# EAGLE design rotarydial (EAGLE 6.6.0)
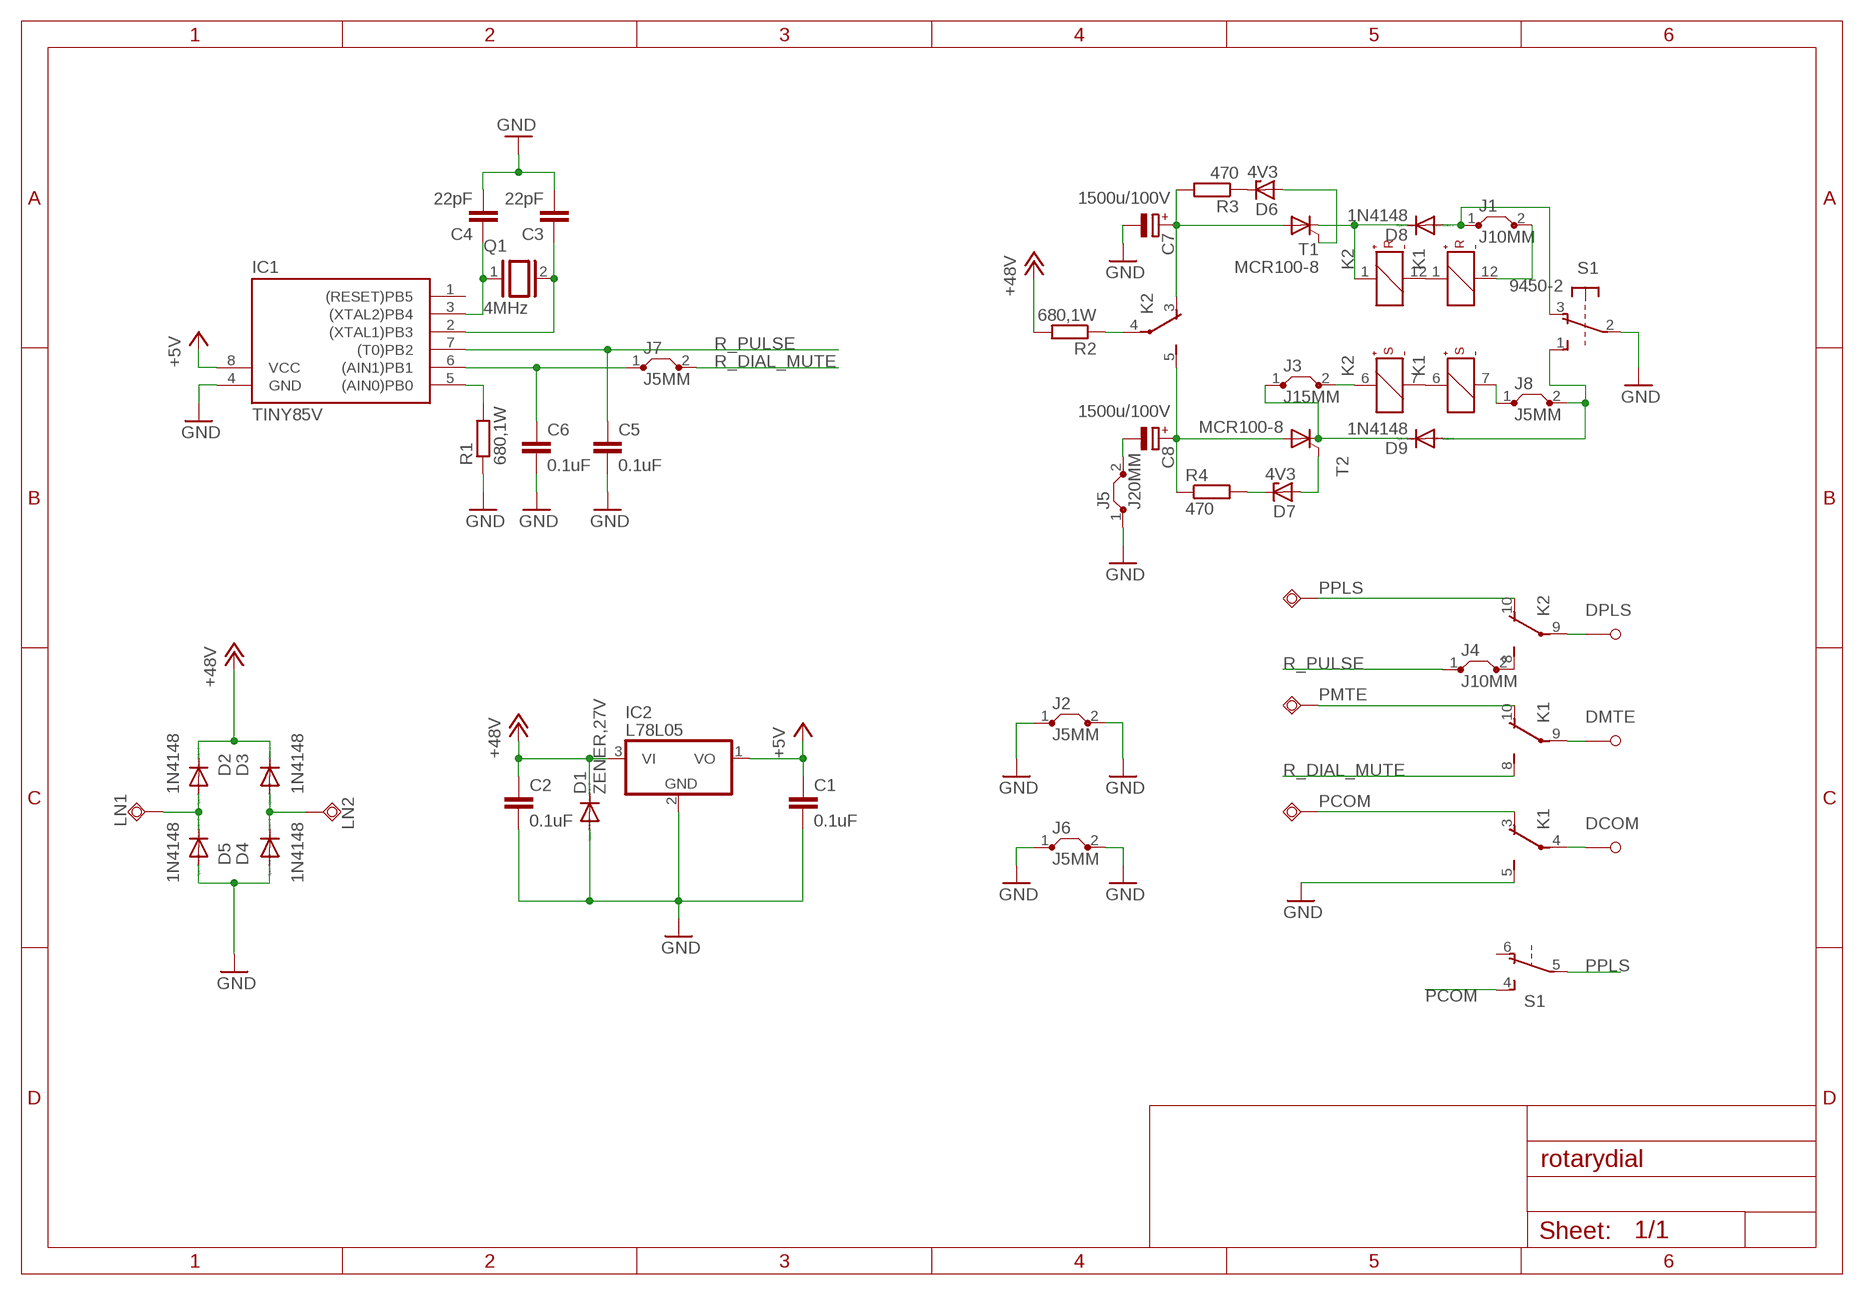
[diagram p0: schematic, sheet 1]

## Parts
C1  0.1uF  C-EU050-025X075  [C050-025X075]
C2  0.1uF  C-EU050-025X075  [C050-025X075]
C3  22pF  C-EU050-024X044  [C050-024X044]
C4  22pF  C-EU050-024X044  [C050-024X044]
C5  0.1uF  C-EU050-025X075  [C050-025X075]
C6  0.1uF  C-EU050-025X075  [C050-025X075]
C7  1500u/100V  CPOL-EUE7.5-18  [E7,5-18]
C8  1500u/100V  CPOL-EUE7.5-18  [E7,5-18]
D1  ZENER,27V  DIODE-P2-15  [P2-15]
D2  1N4148  1N4933  [DO41-10]
D3  1N4148  1N4933  [DO41-10]
D4  1N4148  1N4933  [DO41-10]
D5  1N4148  1N4933  [DO41-10]
D6  4V3  BZV10  [DO34Z7]
D7  4V3  BZV10  [DO34Z7]
D8  1N4148  1N4933  [DO41-10]
D9  1N4148  1N4933  [DO41-10]
DCOM  M3-SCREW-CONNECTOR  [M3-SCREW-CONNECTOR]
DMTE  M3-SCREW-CONNECTOR  [M3-SCREW-CONNECTOR]
DPLS  M3-SCREW-CONNECTOR  [M3-SCREW-CONNECTOR]
IC1  TINY85V  TINY10P  [DIL08]
IC2  L78L05  78L05Z  [TO92]
J1  J10MM  [10]
J2  J5MM  [05]
J3  J15MM  [15]
J4  J10MM  [10]
J5  J20MM  [20]
J6  J5MM  [05]
J7  J5MM  [05]
J8  J5MM  [05]
K1  EC2-3TNU  TX2LT-L2-  [TX2-L2]
K2  EC2-3TNU  TX2LT-L2-  [TX2-L2]
LN1  TPSQPAD1-20  [P1-20]
LN2  TPSQPAD1-20  [P1-20]
PCOM  TPSQPAD1-20  [P1-20]
PMTE  TPSQPAD1-20  [P1-20]
PPLS  TPSQPAD1-20  [P1-20]
Q1  4MHz  XTAL/S  [QS]
R1  680,1W  R-EU_0414/5V  [0414V]
R2  680,1W  R-EU_0414/5V  [0414V]
R3  470  R-EU_0207/7  [0207/7]
R4  470  R-EU_0207/7  [0207/7]
S1  9450-2  [9450-2]
T1  MCR100-8  BT169  [TO92-2]
T2  MCR100-8  BT169  [TO92-2]

## Nets
+5V: C1.1 IC1.8(VCC) IC2.1(VO)
+12V: C2.1 D1.C D2.C D3.C IC2.3(VI) R2.2 ; supply symbol labelled +48V
GND: C1.2 C2.2 C3.2 C4.2 C5.2 C6.2 C7.- C8.- D1.A D4.A D5.A IC1.4(GND) IC2.2(GND) J2.1 J2.2 J5.1 J5.2 J6.1 J6.2 K1.5(1:S) R1.1 S1.2(1:P)
N$1: D2.A D5.C LN1.TP
N$2: D3.A D4.C LN2.TP
N$3: IC1.5((AIN0)PB0) R1.2
N$4: C7.+ K2.3(1:O) R3.2 T1.A
N$5: K1.1(R:+) K2.12(R:-)
N$6: J1.2 K1.12(R:-)
N$7: J3.2 K2.6(S:+)
N$8: D8.C K2.1(R:+) T1.C
N$9: C4.1 IC1.3((XTAL2)PB4) Q1.1
N$10: DPLS.P$1 DPLS.P$2 DPLS.P$3 DPLS.P$4 K2.9(2:P)
N$11: K1.6(S:+) K2.7(S:-)
N$13: C3.1 IC1.2((XTAL1)PB3) Q1.2
N$14: D9.C J3.1 T2.C
N$15: C8.+ K2.5(1:S) R4.1 T2.A
N$16: J8.1 K1.7(S:-)
N$17: D9.A J8.2 S1.1(1:S)
N$18: DMTE.P$1 DMTE.P$2 DMTE.P$3 DMTE.P$4 K1.9(2:P)
N$20: DCOM.P$1 DCOM.P$2 DCOM.P$3 DCOM.P$4 K1.4(1:P)
N$22: D6.C R3.1
N$23: D7.C R4.2
N$24: D6.A T1.G
N$25: D7.A T2.G
N$26: D8.A J1.1 S1.3(1:O)
N$28: J4.2 K2.8(2:S)
PCOM: K1.3(1:O) PCOM.TP S1.4(2:S)
PMTE: K1.10(2:O) PMTE.TP
PPLS: K2.10(2:O) PPLS.TP S1.5(2:P)
R2: K2.4(1:P) R2.1
R_DIAL_MUTE: C6.1 IC1.6((AIN1)PB1) J7.1 J7.2 K1.8(2:S)
R_PULSE: C5.1 IC1.7((T0)PB2) J4.1
Unconnected: IC1.1((RESET)PB5) S1.6(2:O)

## Library data of the parts
C1-C6 = resistor:C-EU: CAPACITOR, European symbol
C7 C8 = resistor-custom:CPOL-EU: POLARIZED CAPACITOR, European symbol
D1 = diode:DIODE-: DIODE
D2-D5 D8 D9 = diode:1N4933: DIODE fast recovery rectifier, 1A
D6 D7 = diode:BZV10: Z DIODE
DCOM DMTE DPLS = m3conn:M3-SCREW-CONNECTOR
IC1 = atmel:TINY10: MICROCONTROLLER 1 Kbytes ROM; OC_FARNELL: unknown; OC_NEWARK: unknown
IC2 = linear:78*: Positive VOLTAGE REGULATOR Source: http://cache.national.com/ds/LM/LM78L05.pdf http://www.fairchildsemi.com/ds/LM/LM7805.pdf
J1-J8 = jumper:J: Bridge
K1 K2 = relay-custom:TX2?-L2-*: TX Relay 2 coil latching NAiS 2 AMP. HIGH CAPACITY RELAY WITH HIGH SURGE VOLTAGE & HIGH BREAKDOWN VOLTAGE Source: http://www.mew-europe.com/.. en_ds_61022_0001.pdf TX-S SMALL POLARIZED WITH HIGH SENSITIVITY 50mW Source: http://www.mew-europe.com/.. en_ds_61022_0022.pdf
LN1 LN2 PCOM PMTE PPLS = testpad:TPSQ: Test pad
Q1 = special:XTAL/S: CRYSTAL
R1-R4 = resistor:R-EU_: RESISTOR, European symbol
S1 = switch-misc:9450-2: MARQUARDT SWITCH
T1 T2 = triac:BT169: THYRISTOR

## Board
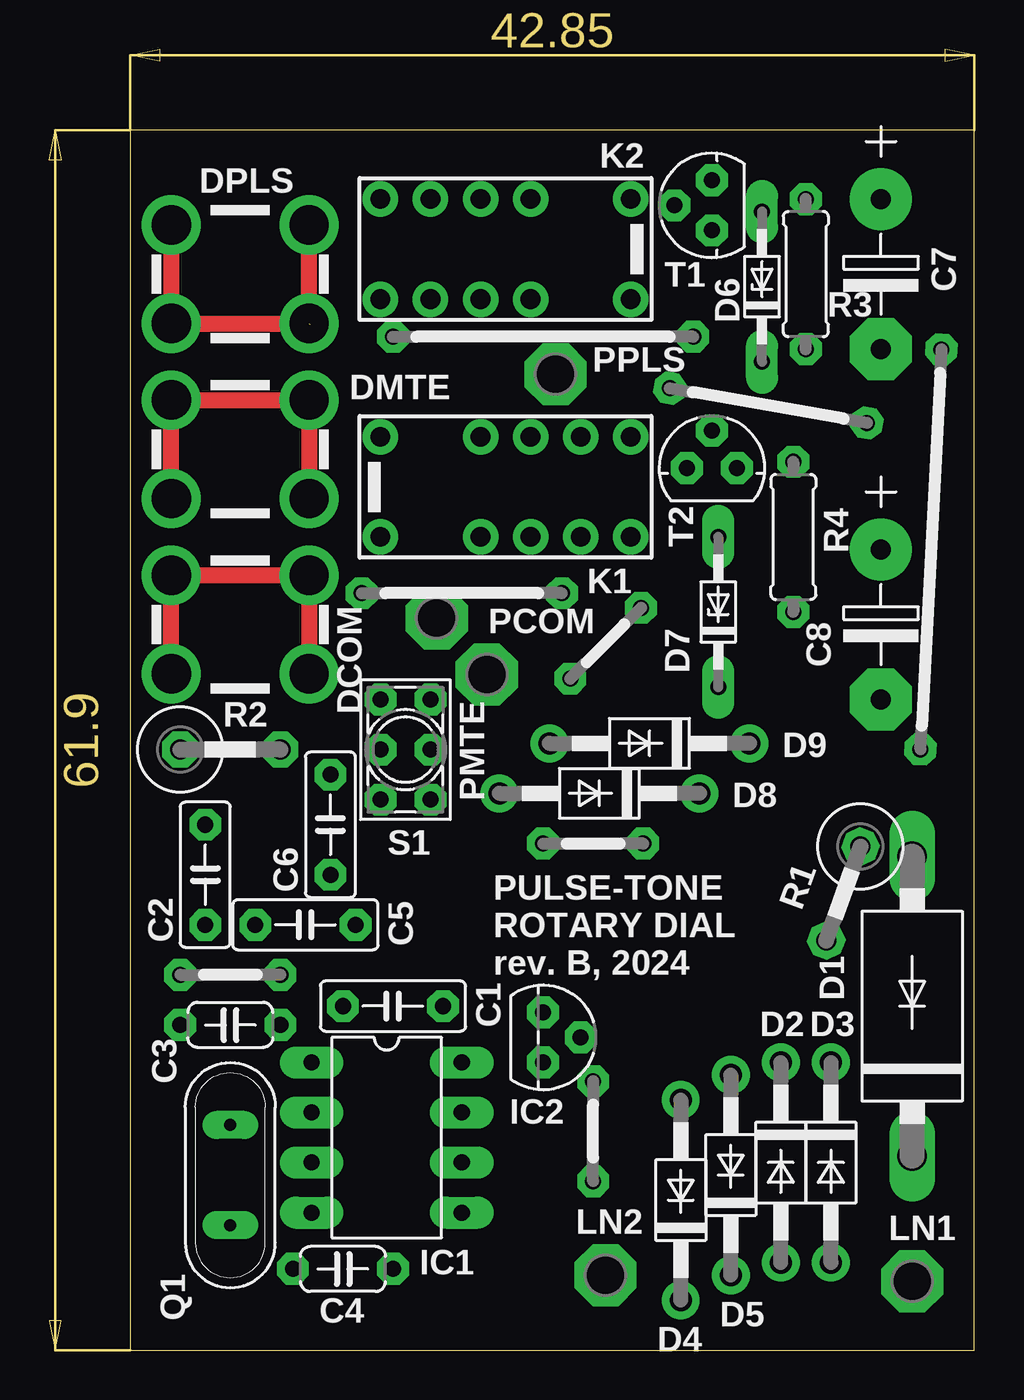
[diagram p1: board, top side]
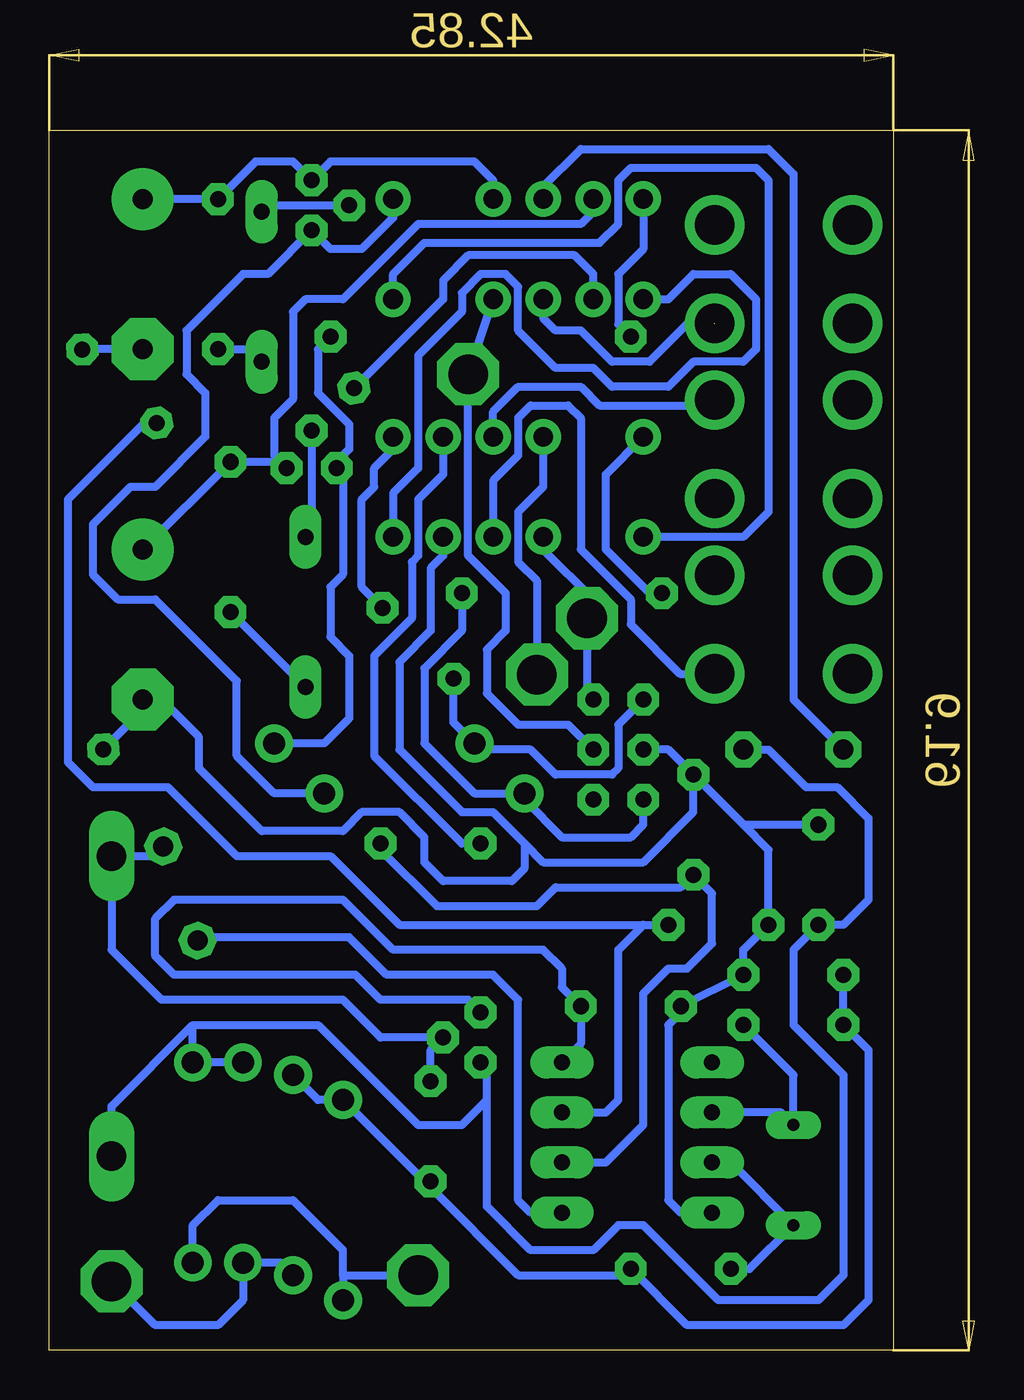
[diagram p2: board, bottom side, seen from below]

Size 42.85 x 61.9 mm. Coordinates in mm from the lower left corner, seen from the top.
Outline: 0,0 42.85,0 42.85,61.9 0,61.9 0,0
Copper layers (1*16): Top 0.035mm / dielectric 1.5mm / Bottom 0.035mm
Design rules "default *": minimum track width 0.3mm, minimum drill 0.6mm, track to track 6mil, track to pad 6mil, pad to pad 6mil, via to via 6mil, smd to smd 0mil, copper to edge 0.3mm, drill to drill 0.5mm, minimum pad ring 0.4mm, minimum via ring 8mil, stop-mask expansion 4mil, vias tented up to drill 0mil, thermal gap 10mil

### Footprints (pad centres in the part's own frame; a part is rotated, then mirrored left to right if it is on the bottom)
C050-025X075 = drill 0.813 octagon: 1 -2.54,0; 2 2.54,0
C050-024X044 = drill 0.813 octagon: 1 -2.54,0; 2 2.54,0
E7,5-18 = drill 1.016 pad 3.15: + -3.81,0 | drill 1.016 pad 3.15 octagon: - 3.81,0
P2-15 = drill 1.499 long: A 7.62,0; C -7.62,0
DO41-10 = drill 1.118: A 5.08,0; C -5.08,0
DO34Z7 = drill 0.813 long: A 3.81,0; C -3.81,0
M3-SCREW-CONNECTOR = drill 2: P$1 -2.5,3; P$2 2.5,3; P$3 -2.5,-4; P$4 2.5,-4
DIL08 = drill 0.813 long: 1 -3.81,-3.81; 2 -1.27,-3.81; 3 1.27,-3.81; 4 3.81,-3.81; 5 3.81,3.81; 6 1.27,3.81; 7 -1.27,3.81; 8 -3.81,3.81
TO92 = drill 0.813 octagon: 1 -1.27,0; 2 0,1.905; 3 1.27,0
10 = drill 0.813 pad 1.6 octagon: 1 -5.08,0; 2 5.08,0
05 = drill 0.813 pad 1.6 octagon: 1 -2.54,0; 2 2.54,0
15 = drill 0.813 pad 1.6 octagon: 1 -7.62,0; 2 7.62,0
20 = drill 0.813 pad 1.6 octagon: 1 -10.16,0; 2 10.16,0
TX2-L2 = drill 1: 1 -6.35,-2.54; 3 -1.27,-2.54; 4 1.27,-2.54; 5 3.81,-2.54; 6 6.35,-2.54; 7 6.35,2.54; 8 3.81,2.54; 9 1.27,2.54; 10 -1.27,2.54; 12 -6.35,2.54
P1-20 = drill 2.007 pad 3.15 octagon: TP 0,0
QS = drill 0.61 long: 1 -2.54,0; 2 2.54,0
0414V = drill 1.016 octagon: 1 -2.54,0; 2 2.54,0
0207/7 = drill 0.813 octagon: 1 -3.81,0; 2 3.81,0
9450-2 = drill 0.813 octagon: 1 -2.54,-1.27; 2 0,-1.27; 3 2.54,-1.27; 4 -2.54,1.27; 5 0,1.27; 6 2.54,1.27
TO92-2 = drill 0.813 octagon: A 1.27,0; C -1.27,0; G 0,1.905

### Placement (x,y rotation side)
C1  13.34,17.46 180 top
C2  3.81,24.13 90 top
C3  5.08,16.51 180 top
C4  10.79,4.13 0 top
C5  8.89,21.59 180 top
C6  10.16,26.67 90 top
C7  38.1,54.61 270 top
C8  38.1,36.83 270 top
D1  39.69,17.46 90 top
D2  33.02,9.53 270 top
D3  35.56,9.53 270 top
D4  27.94,7.62 90 top
D5  30.48,8.89 90 top
D6  32.07,53.98 90 top
D7  29.84,37.47 90 top
D8  23.81,28.26 180 top
D9  26.35,30.8 180 top
DCOM  5.08,36.83 90 top
DMTE  5.08,45.72 90 top
DPLS  5.08,54.61 90 top
IC1  13.02,10.79 270 top
IC2  20.95,15.88 270 top
J1  16.83,38.42 180 top
J2  23.5,11.11 90 top
J3  20.95,51.44 180 top
J4  32.38,47.94 170 top
J5  40.64,40.64 267 top
J6  5.08,19.05 180 top
J7  23.5,25.72 0 top
J8  24.13,35.88 225 top
K1  19.05,43.81 0 top
K2  19.05,55.88 180 top
LN1  39.69,3.49 0 top
LN2  24.13,3.81 0 top
PCOM  15.56,37.15 0 top
PMTE  18.1,34.29 0 top
PPLS  21.59,49.53 0 top
Q1  5.08,8.89 90 top
R1  36.2,23.18 250 top
R2  5.08,30.48 0 top
R3  34.29,54.61 90 top
R4  33.66,41.27 270 top
S1  13.97,30.48 270 top
T1  29.53,58.1 90 top
T2  29.53,44.77 0 top

### Tracks (layer width: path | path; a pad name or v marks a point on that pad's centre or on a via)
+5V
  Bottom 0.406: IC1.8 15.88,15.56 C1.1 16.83,18.41 16.83,19.37 17.78,20.32 25.4,20.32 27.94,22.86 36.51,22.86 37.47,21.91 37.47,20 36.51,19.05 27.3,19.05 26.04,17.78 21.59,17.78 IC2.1
+12V
  Bottom 0.406: R2.2 6.35,30.48 4.45,28.57 2.86,28.57 1.27,26.99 1.27,22.86 2.54,21.59 C2.1 5.08,20.32 5.08,16.51 2.54,13.97 2.54,3.81 3.81,2.54 8.89,2.54 12.7,6.35 13.97,6.35 15.24,5.08 18.41,5.08 20.64,7.3 20.64,12.7 | 20.64,12.7 20.64,14.29 IC2.3 | D1.C 39.69,12.38 35.56,16.51 | 35.56,16.51 29.21,16.51 24.13,11.43 21.91,11.43 20.64,12.7 | D2.C D3.C 35.56,16.51
GND
  Top 0.406: J6.1 J6.2 | J2.2 J2.1 | J5.2 J5.1
  Bottom 0.406: K1.5 22.86,40.32 23.5,39.69 23.5,36.51 25.08,34.92 25.08,30.48 21.91,27.3 20.32,27.3 18.73,25.72 | C6.2 11.43,30.48 S1.2 | 18.73,25.72 18.73,24.45 19.37,23.81 22.86,23.81 23.81,24.77 23.81,26.04 25.08,27.3 26.99,27.3 27.94,26.35 32.07,26.35 35.24,29.53 35.24,31.11 37.15,33.02 C8.- 38.1,32.5 J5.2 | 18.73,25.72 17.78,24.77 12.7,24.77 10.16,27.3 C6.2 | C6.2 7.62,26.67 | 7.62,26.67 C2.2 | 7.62,26.67 6.35,25.4 C5.2 7.62,20.32 J6.1 C1.2 10.79,17.14 11.43,16.51 11.43,7.62 10.79,6.99 IC1.4 | J6.2 C3.2 1.27,15.24 1.27,2.54 2.54,1.27 10.48,1.27 C4.2 13.65,3.81 19.05,3.81 23.5,8.26 | R1.1 37.47,25.08 D1.A 39.69,20.32 37.15,17.78 27.94,17.78 26.04,15.88 IC2.2 23.5,15.24 J2.2 | 23.5,8.26 J2.1 23.81,8.57 | C7.- 41.16,50.8 J5.1 | 23.5,8.26 D4.A 29.21,12.7 D5.A
N$1
  Bottom 0.406: LN1.TP 37.47,1.27 34.29,1.27 33.02,2.54 D2.A 31.11,4.45 D5.C
N$2
  Bottom 0.406: D3.A 35.56,6.35 34.29,7.62 30.48,7.62 27.94,5.08 27.94,3.81 | 27.94,3.81 LN2.TP | 27.94,3.81 D4.C
N$3
  Bottom 0.406: IC1.5 18.41,6.99 19.05,7.62 19.05,17.78 20.32,19.05 25.72,19.05 27.62,20.95 35.16,20.95 R1.2
N$4
  Bottom 0.406: K2.3 20.32,59.37 21.27,60.33 28.57,60.33 T1.A 30.48,60.33 32.38,60.33 R3.2 C7.+
N$5
  Bottom 0.406: K1.1 7.62,41.27 6.35,42.55 6.35,59.37 6.99,60.01 13.34,60.01 13.97,59.37 13.97,57.15 14.92,56.2 23.81,56.2 25.4,54.61 K2.12
N$6
  Bottom 0.406: J1.2 12.38,38.42 14.61,40.64 14.61,44.45 K1.12
N$7
  Bottom 0.406: K2.6 12.7,55.88 13.97,54.61 13.97,52.07 J3.2
N$8
  Bottom 0.406: K2.1 25.4,57.47 26.99,55.88 28.57,55.88 T1.C 31.75,54.61 33.02,54.61 35.88,51.75 35.88,49.53 34.92,48.58 34.92,46.35 37.47,43.81 38.73,43.81 40.64,41.91 40.64,39.37 39.37,38.1 37.47,38.1 33.34,33.97 33.34,30.16 31.43,28.26 D8.C
N$9
  Bottom 0.406: IC1.3 8.26,9.53 Q1.1 7.3,4.13 C4.1
N$10  (1 unrouted)
  Top 0.813: DPLS.P$2 DPLS.P$1 DPLS.P$3 DPLS.P$4
  Bottom 0.406: K2.9 17.78,52.39 17.14,51.75 15.88,51.75 14.29,50.16 12.38,50.16 10.48,52.07 9.12,52.07
N$11
  Bottom 0.406: K2.7 11.43,53.34 10.16,54.61 8.26,54.61 6.99,53.34 6.99,50.8 7.62,50.16 10.16,50.16 11.43,48.9 14.29,48.9 15.24,49.85 17.14,49.85 19.05,51.75 19.05,53.98 19.68,54.61 20.95,54.61 21.91,53.66 21.91,52.7 24.13,50.48 24.13,44.77 25.4,43.5 K1.6
N$13
  Bottom 0.406: C3.1 5.08,13.97 Q1.2 5.71,12.06 IC1.2
N$14
  Bottom 0.406: J3.1 29.21,50.8 29.21,48.58 27.62,46.99 27.62,45.72 28.26,45.09 T2.C 27.94,44.45 27.94,39.37 28.57,38.73 28.57,36.2 27.62,35.24 27.62,32.07 28.89,30.8 D9.C
N$15
  Bottom 0.406: C8.+ R4.1 31.11,45.09 T2.A 31.43,45.4 31.43,47.31 30.48,48.26 30.48,52.7 29.84,53.34 27.94,53.34 24.13,57.15 15.88,57.15 15.24,57.78 K2.5
N$16
  Bottom 0.406: J8.1 26.99,38.73 26.99,43.18 26.35,43.81 26.35,44.77 25.4,45.72 K1.7
N$17
  Bottom 0.406: S1.1 13.97,31.75 13.97,29.53 14.29,29.21 17.14,29.21 18.41,30.48 20.95,30.48 D9.A 22.33,31.86 J8.2
N$18
  Top 0.813: DMTE.P$1 DMTE.P$2 DMTE.P$4 DMTE.P$3
  Bottom 0.406: K1.9 20.32,47.62 19.05,48.9 15.88,48.9 14.92,47.94 9.12,47.94 DMTE.P$4
N$20
  Top 0.813: DCOM.P$1 DCOM.P$2 DCOM.P$4 DCOM.P$3
  Bottom 0.406: DCOM.P$3 10.84,34.33 13.34,36.83 13.34,38.1 15.88,40.64 15.88,47.31 16.51,47.94 18.41,47.94 19.05,47.31 19.05,45.4 20.32,44.13 K1.4
N$22
  Bottom 0.406: R3.1 32.7,50.8 D6.C
N$23
  Bottom 0.406: R4.2 D7.C
N$24
  Bottom 0.406: D6.A 31.75,58.1 T1.G
N$25
  Bottom 0.406: T2.G 29.53,41.59 D7.A
N$26
  Bottom 0.406: J1.1 21.91,36.51 23.81,34.61 23.81,30.8 21.27,28.26 D8.A 18.73,27.94 16.83,26.04 13.34,26.04 12.7,26.67 S1.3
N$28
  Bottom 0.406: 27.3,48.9 J4.2 24.14,52.07 22.86,53.34 22.86,54.29 21.59,55.56 16.19,55.56 15.24,54.61 K2.8
PCOM
  Bottom 0.406: K1.3 17.78,40.64 15.24,38.1 15.24,37.47 PCOM.TP 15.56,33.34 S1.4
PMTE
  Bottom 0.406: K1.10 17.78,43.81 19.05,42.55 19.05,40.01 18.1,39.05 PMTE.TP
PPLS
  Bottom 0.406: K2.10 PPLS.TP 21.59,40.32 19.68,38.42 19.68,36.51 20.64,35.56 20.64,33.34 19.05,31.75 16.51,31.75 S1.5
R2
  Bottom 0.406: K2.4 17.78,59.05 15.88,60.96 6.35,60.96 5.08,59.69 5.08,33.02 R2.1
R_DIAL_MUTE
  Top 0.406: J7.1 J7.2
  Bottom 0.406: K1.8 22.86,44.45 24.13,43.18 24.13,40.32 24.45,40.01 24.45,37.15 26.35,35.24 26.35,30.16 21.91,25.72 J7.1 | J7.2 26.04,25.4 23.18,22.54 18.1,22.54 17.14,23.5 10.79,23.5 C6.1 9.21,23.18 9.21,20.64 10.48,19.37 11.43,19.37 12.7,18.1 12.7,11.43 14.61,9.53 IC1.6
R_PULSE
  Bottom 0.406: J4.1 38.03,47.06 41.91,43.18 41.91,29.84 40.64,28.57 36.83,28.57 33.34,25.08 28.57,25.08 25.08,21.59 12.7,21.59 | IC1.7 14.61,12.06 13.97,12.7 13.97,20.32 12.7,21.59 | 12.7,21.59 C5.1

### Text on the board
tNames: PULSE-TONE / ROTARY DIAL / rev. B, 2024